# EAGLE design MCU (EAGLE 9.0.0)
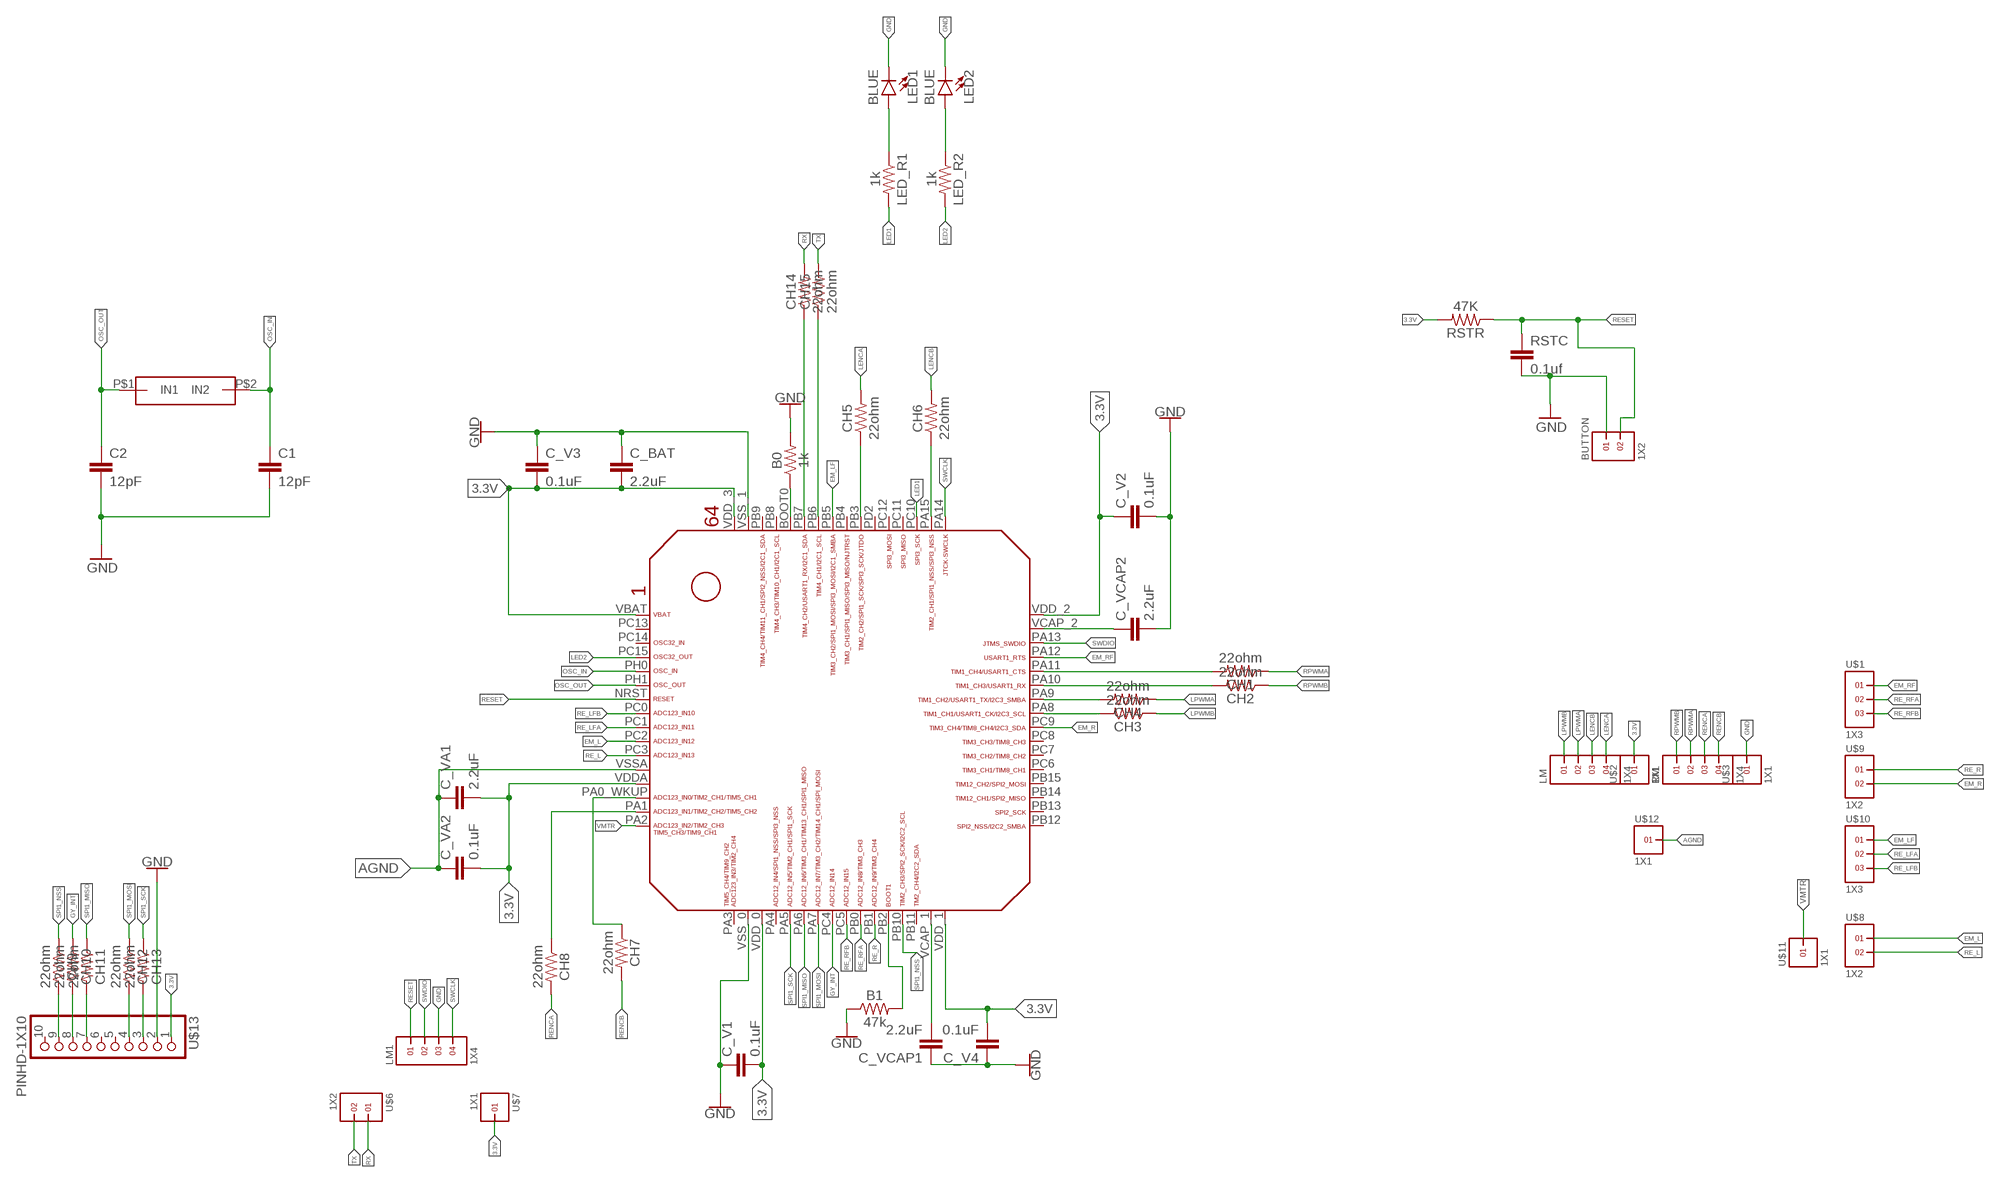
[diagram p0: schematic, sheet 1]

## Parts
B0  1k  0.75OHM-0805-1/4W-1%  [0805]
B1  47k  0.75OHM-0805-1/4W-1%  [0805]
BUTTON  1X2  [1X2]
C1  12pF  22PF-0603-50V-5%  [0603]
C2  12pF  22PF-0603-50V-5%  [0603]
C_BAT  2.2uF  22UF-0805-6.3V-20%  [0805]
C_V1  0.1uF  22UF-0805-6.3V-20%  [0805]
C_V2  0.1uF  22UF-0805-6.3V-20%  [0805]
C_V3  0.1uF  22UF-0805-6.3V-20%  [0805]
C_V4  0.1uF  22UF-0805-6.3V-20%  [0805]
C_VA1  2.2uF  22UF-0805-6.3V-20%  [0805]
C_VA2  0.1uF  22UF-0805-6.3V-20%  [0805]
C_VCAP1  2.2uF  22UF-0805-6.3V-20%  [0805]
C_VCAP2  2.2uF  22UF-0805-6.3V-20%  [0805]
CH1  22ohm  0.75OHM-0805-1/4W-1%  [0805]
CH2  22ohm  0.75OHM-0805-1/4W-1%  [0805]
CH3  22ohm  0.75OHM-0805-1/4W-1%  [0805]
CH4  22ohm  0.75OHM-0805-1/4W-1%  [0805]
CH5  22ohm  0.75OHM-0805-1/4W-1%  [0805]
CH6  22ohm  0.75OHM-0805-1/4W-1%  [0805]
CH7  22ohm  0.75OHM-0805-1/4W-1%  [0805]
CH8  22ohm  0.75OHM-0805-1/4W-1%  [0805]
CH9  22ohm  0.75OHM-0805-1/4W-1%  [0805]
CH10  22ohm  0.75OHM-0805-1/4W-1%  [0805]
CH11  22ohm  0.75OHM-0805-1/4W-1%  [0805]
CH12  22ohm  0.75OHM-0805-1/4W-1%  [0805]
CH13  22ohm  0.75OHM-0805-1/4W-1%  [0805]
CH14  22ohm  0.75OHM-0805-1/4W-1%  [0805]
CH15  22ohm  0.75OHM-0805-1/4W-1%  [0805]
LED1  BLUE  LED-BLUE1206  [LED-1206]
LED2  BLUE  LED-BLUE1206  [LED-1206]
LED_R1  1k  0.75OHM-0805-1/4W-1%  [0805]
LED_R2  1k  0.75OHM-0805-1/4W-1%  [0805]
LM  1X4  [1X4]
LM1  1X4  [1X4]
RM  1X4  [1X4]
RSTC  0.1uf  22UF-0805-6.3V-20%  [0805]
RSTR  47K  0.75OHM-0805-1/4W-1%  [0805]
U$1  1X3  [1X3]
U$2  1X1  [1X1]
U$3  1X1  [1X1]
U$4  STM32F405/415_LQFP64  [STM32F405/415_LQFP64]
U$5  OSC  [OSC]
U$6  1X2  [1X2]
U$7  1X1  [1X1]
U$8  1X2  [1X2]
U$9  1X2  [1X2]
U$10  1X3  [1X3]
U$11  1X1  [1X1]
U$12  1X1  [1X1]
U$13  PINHD-1X10  [1X10-BIG]

## Nets
3.3V: C_BAT.2 C_V1.2 C_V2.1 C_V3.2 C_V4.2 C_VA1.2 C_VA2.2 RSTR.2 U$2.1 U$4.VBAT U$4.VDD_0 U$4.VDD_1 U$4.VDD_2 U$4.VDD_3 U$4.VDDA U$7.1 U$13.1
AGND: C_VA1.1 C_VA2.1 U$4.VSSA U$12.1
EM_L: U$4.PC2 U$8.1
EM_LF: U$4.PB5 U$10.1
EM_R: U$4.PC9 U$9.2
EM_RF: U$1.1 U$4.PA12
GND: B0.2 B1.1 BUTTON.1 C1.2 C2.2 C_BAT.1 C_V1.1 C_V2.2 C_V3.1 C_V4.1 C_VCAP1.1 C_VCAP2.2 LED1.C LED2.C LM1.3 RSTC.2 U$3.1 U$4.VSS_0 U$4.VSS_1 U$13.2
GY_INT: CH10.1 U$4.PC4
INT: CH10.2 U$13.8
LED1: LED_R1.2 U$4.PC10
LED2: LED_R2.2 U$4.PC15
LENCA: CH5.2 LM.4
LENCB: CH6.2 LM.3
LPWMA: CH4.1 LM.2
LPWMB: CH3.1 LM.1
MISO: CH11.2 U$13.7
MOSI: CH12.2 U$13.4
N$1: CH3.2 U$4.PA8
N$2: CH4.2 U$4.PA9
N$3: CH1.2 U$4.PA11
N$4: CH2.2 U$4.PA10
N$5: CH6.1 U$4.PA15
N$6: CH5.1 U$4.PB3
N$7: CH7.1 U$4.PA0_WKUP(PA0_AKUP)
N$8: CH8.1 U$4.PA1
N$9: B1.2 U$4.PB2
N$10: B0.1 U$4.BOOT0
N$11: CH14.1 U$4.PB7
N$12: CH15.1 U$4.PB6
N$13: LED2.A LED_R2.1
N$14: LED1.A LED_R1.1
NSS: CH9.2 U$13.9
OSC_IN: C1.1 U$4.PH0 U$5.P$2(IN2)
OSC_OUT: C2.1 U$4.PH1 U$5.P$1(IN1)
RE_L: U$4.PC3 U$8.2
RE_LFA: U$4.PC1 U$10.2
RE_LFB: U$4.PC0 U$10.3
RE_R: U$4.PB1 U$9.1
RE_RFA: U$1.2 U$4.PB0
RE_RFB: U$1.3 U$4.PC5
RENCA: CH8.2 RM.3
RENCB: CH7.2 RM.4
RESET: BUTTON.2 LM1.1 RSTC.1 RSTR.1 U$4.NRST
RPWMA: CH1.1 RM.2
RPWMB: CH2.1 RM.1
RX: CH14.2 U$6.1
SCK: CH13.2 U$13.3
SPI1_MISO: CH11.1 U$4.PA6
SPI1_MOSI: CH12.1 U$4.PA7
SPI1_NSS: CH9.1 U$4.PB10
SPI1_SCK: CH13.1 U$4.PA5
SWCLK: LM1.4 U$4.PA14
SWDIO: LM1.2 U$4.PA13
TX: CH15.2 U$6.2
VCAP_1: C_VCAP1.2 U$4.VCAP_1
VCAP_2: C_VCAP2.1 U$4.VCAP_2
VMTR: U$4.PA2 U$11.1
Unconnected: U$4.PA3 U$4.PA4 U$4.PB4 U$4.PB8 U$4.PB9 U$4.PB11 U$4.PB12 U$4.PB13 U$4.PB14 U$4.PB15 U$4.PC6 U$4.PC7 U$4.PC8 U$4.PC11 U$4.PC12 U$4.PC13 U$4.PC14 U$4.PD2 U$13.5 U$13.6 U$13.10

## Library data of the parts
B0 B1 CH1-CH15 LED_R1 LED_R2 RSTR = SparkFun-Resistors:0.75OHM: 0.75Ω resistor A resistor is a passive two-terminal electrical component that implements electrical resistance as a circuit element. Resistors act to reduce current flow, and, at the same time, act to lower voltage levels within circuits. - Wikipedia; PROD_ID: RES-08474; VALUE: 0.75
BUTTON U$6 U$8 U$9 = headers(2mm):1X2
C1 C2 = SparkFun-Capacitors:22PF: 22pF ceramic capacitors A capacitor is a passive two-terminal electrical component used to store electrical energy temporarily in an electric field.; PROD_ID: CAP-07876; VALUE: 22pF
C_BAT C_V1-C_V4 C_VA1 C_VA2 C_VCAP1 C_VCAP2 RSTC = SparkFun-Capacitors:22UF: 22µF ceramic capacitors A capacitor is a passive two-terminal electrical component used to store electrical energy temporarily in an electric field.; PROD_ID: CAP-08402; VALUE: 22uF
LED1 LED2 = SparkFun-LED:LED-BLUE: Blue SMD LED Used in manufacturing of various products at SparkFun Packages: 0603 - SMD 0603 package [Product Link] <http://www.digikey.com/product-detail/en/SMLE12BC7TT86/511-1589-2-ND/1641808> 1206 - SMD1206 package [Product Link] <http://www.digikey.com/product-detail/en/lite-on-inc/LTST-C150TBKT/160-1643-1-ND/573584> SparkFun Products: ESP8266 Thing-Dev Board <https://www.sparkfun.com/products/13711> RedBoard <https://www.sparkfun.com/products/12757>; PROD_ID: DIO-09911
LM LM1 RM = headers(2mm):1X4
U$1 U$10 = headers(2mm):1X3
U$2 U$3 U$7 U$11 U$12 = headers(2mm):1X1
U$4 = STM32F405RG:STM32F405/415_LQFP64
U$5 = Cristal Oscillator:OSC
U$13 = adafruit:PINHD-1X10: Pin header 1x10 0.1" spacing With round pins

## Board
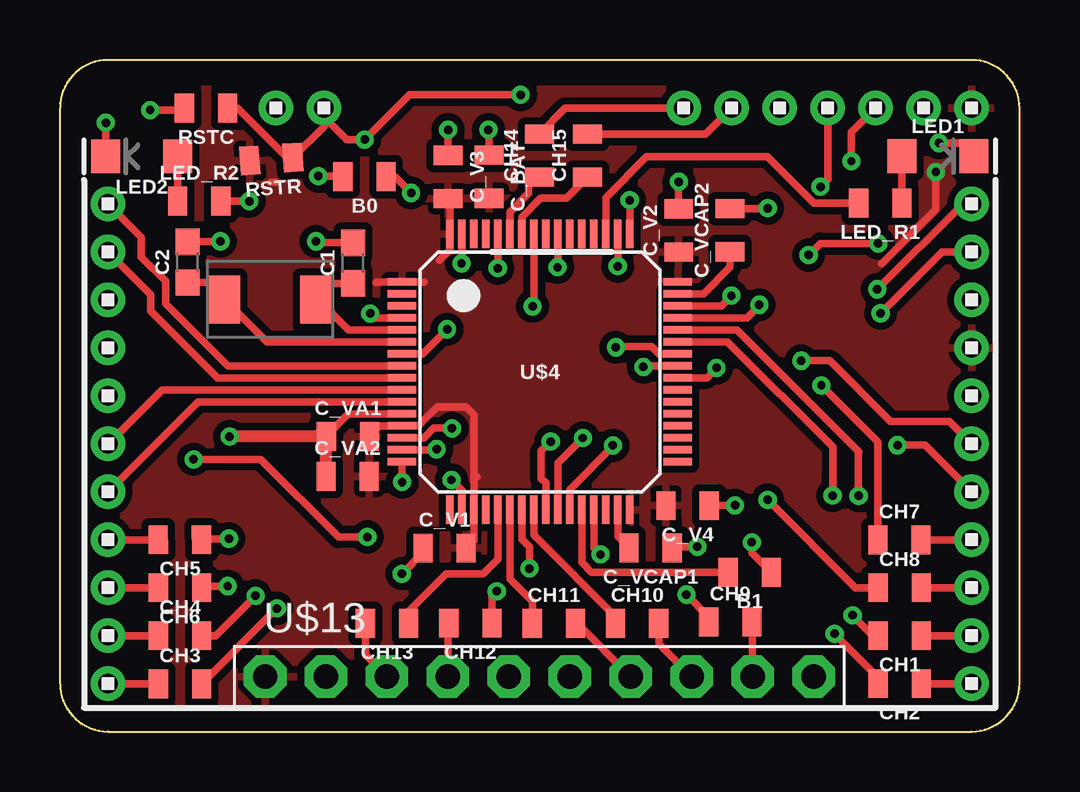
[diagram p1: board, top side]
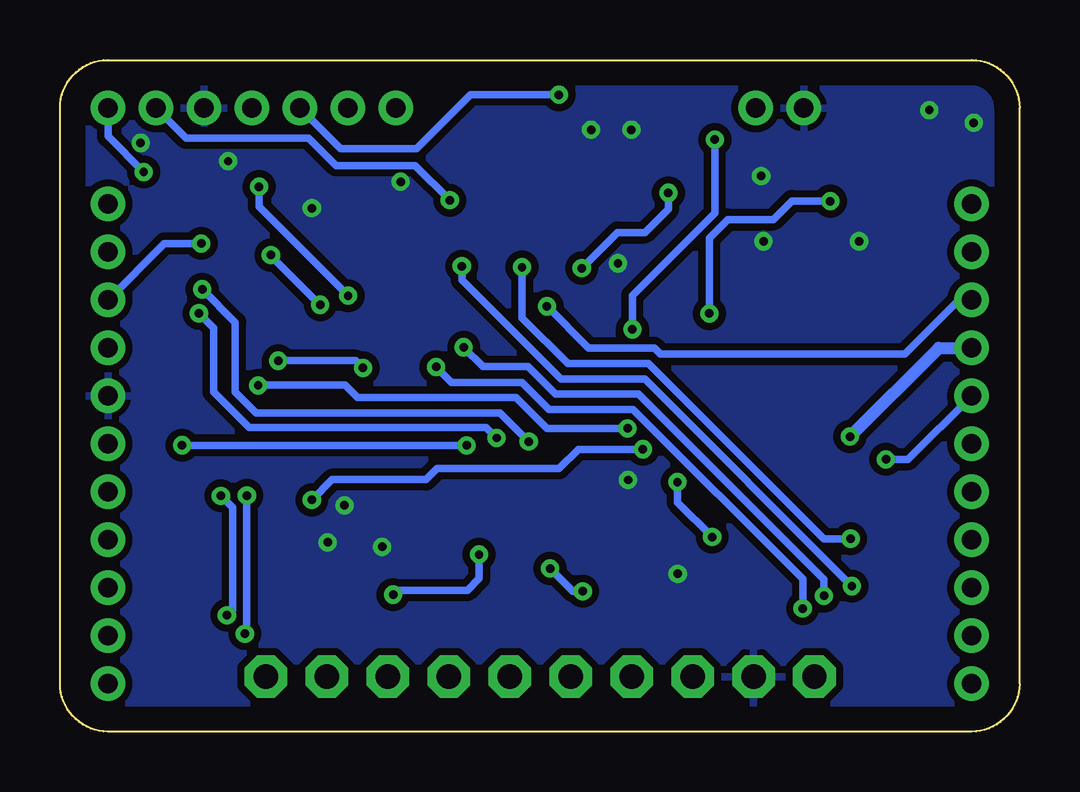
[diagram p2: board, bottom side, seen from below]

Size 40 x 28 mm. Coordinates in mm from the lower left corner, seen from the top.
Outline: 0,2 0,26 arc-90 2,28 38,28 arc-90 40,26 40,2 arc-90 38,0 2,0 arc-90 0,2
Copper layers (1*16): Top 0.035mm / dielectric 1.5mm / Bottom 0.035mm
Design rules "default": minimum track width 6mil, minimum drill 0.35mm, track to track 6mil, track to pad 6mil, pad to pad 6mil, via to via 6mil, smd to smd 6mil, copper to edge 40mil, drill to drill 6mil, minimum pad ring 10mil, minimum via ring 8mil, stop-mask expansion 4mil, vias tented up to drill 0mil, thermal gap 10mil

### Footprints (pad centres in the part's own frame; a part is rotated, then mirrored left to right if it is on the bottom)
0805 = smd 0.8 x 1.2: 1 -0.9,0; 2 0.9,0
1X2 = drill 0.8 pad 1.422: 1 -1,0; 2 1,0
0603 = smd 1.1 x 1: 1 -0.85,0; 2 0.85,0
LED-1206 = smd 1.2 x 1.4: A -1.5,0; C 1.5,0
1X4 = drill 0.8 pad 1.422: 1 -3,0; 2 -1,0; 3 1,0; 4 3,0
1X3 = drill 0.8 pad 1.422: 1 -2,0; 2 0,0; 3 2,0
1X1 = drill 0.8 pad 1.422: 1 0,0
STM32F405/415_LQFP64 = smd 0.3 x 1.2: BOOT0 -1.75,5.75; PA3 -3.75,-5.75; PA4 -2.25,-5.75; PA5 -1.75,-5.75; PA6 -1.25,-5.75; PA7 -0.75,-5.75; PA14 3.75,5.75; PA15 3.25,5.75; PB0 0.75,-5.75; PB1 1.25,-5.75; PB2 1.75,-5.75; PB3 0.75,5.75; PB4 0.25,5.75; PB5 -0.25,5.75; PB6 -0.75,5.75; PB7 -1.25,5.75; PB8 -2.25,5.75; PB9 -2.75,5.75; PB10 2.25,-5.75; PB11 2.75,-5.75; PC4 -0.25,-5.75; PC5 0.25,-5.75; PC10 2.75,5.75; PC11 2.25,5.75; PC12 1.75,5.75; PD2 1.25,5.75; VCAP_1 3.25,-5.75; VDD_0 -2.75,-5.75; VDD_1 3.75,-5.75; VDD_3 -3.75,5.75; VSS_0 -3.25,-5.75; VSS_1 -3.25,5.75 | smd 1.2 x 0.3: NRST -5.75,0.75; PA0_WKUP -5.75,-2.75; PA1 -5.75,-3.25; PA2 -5.75,-3.75; PA8 5.75,0.25; PA9 5.75,0.75; PA10 5.75,1.25; PA11 5.75,1.75; PA12 5.75,2.25; PA13 5.75,2.75; PB12 5.75,-3.75; PB13 5.75,-3.25; PB14 5.75,-2.75; PB15 5.75,-2.25; PC0 -5.75,0.25; PC1 -5.75,-0.25; PC2 -5.75,-0.75; PC3 -5.75,-1.25; PC6 5.75,-1.75; PC7 5.75,-1.25; PC8 5.75,-0.75; PC9 5.75,-0.25; PC13 -5.75,3.25; PC14 -5.75,2.75; PC15 -5.75,2.25; PH0 -5.75,1.75; PH1 -5.75,1.25; VBAT -5.75,3.75; VCAP_2 5.75,3.25; VDD_2 5.75,3.75; VDDA -5.75,-2.25; VSSA -5.75,-1.75
OSC = smd 1.3 x 2: P$1 0,0.1; P$2 3.8,0.1
1X10-BIG = drill 1.016 pad 1.778 octagon: 1 -11.43,0; 2 -8.89,0; 3 -6.35,0; 4 -3.81,0; 5 -1.27,0; 6 1.27,0; 7 3.81,0; 8 6.35,0; 9 8.89,0; 10 11.43,0

### Placement (x,y rotation side)
B0  12.69,23.13 180 top
B1  28.75,6.64 180 top
BUTTON  10,26 0 top
C1  12.21,19.53 90 top
C2  5.32,19.57 90 top
C_BAT  17.88,23.13 270 top
C_V1  16.03,7.65 0 top
C_V2  25.79,20.89 90 top
C_V3  16.18,23.12 270 top
C_V4  26.16,9.42 180 top
C_VA1  12,12.3 0 top
C_VA2  11.99,10.64 0 top
C_VCAP1  24.62,7.66 180 top
C_VCAP2  27.93,20.9 90 top
CH1  35,4 180 top
CH2  35,2 180 top
CH3  5,1.99 0 top
CH4  5,4 0 top
CH5  5,8 180.1 top
CH6  5,6 180 top
CH7  34.99,7.99 0 top
CH8  35,6 0 top
CH9  27.94,4.57 0 top
CH10  24.06,4.51 0 top
CH11  20.59,4.51 0 top
CH12  17.11,4.52 180 top
CH13  13.63,4.51 180 top
CH14  19.99,24.01 90 top
CH15  21.99,24.01 90 top
LED1  36.59,23.99 0 top
LED2  3.41,23.98 180 top
LED_R1  34.19,22.03 180 top
LED_R2  5.81,22.11 0 top
LM  2,5 90 top
LM1  33,26 0 top
RM  38,5 90 top
RSTC  6.09,25.99 180 top
RSTR  8.81,23.87 184.1 top
U$1  38,20 90 top
U$2  38,16 0 top
U$3  38,14 0 top
U$4  20,15 0 top
U$5  6.86,17.92 0 top
U$6  27,26 0 top
U$7  38,26 0 top
U$8  2,11 270 top
U$9  38,11 90 top
U$10  2,20 90 top
U$11  2,14 0 top
U$12  2,16 0 top
U$13  19.98,2.29 0 top

### Tracks (layer width: path | path; a pad name or v marks a point on that pad's centre or on a via)
3.3V  (via drill 0.35)
  Top 0.305: C_V3.2 16.25,22.15 U$4.VDD_3 16.25,20.08 15.82,19.65 | C_VA1.2 13.32,12.75 U$4.VDDA 14.93,12.75 15.16,12.97 15.16,12.98 15.71,13.53 16.92,13.53 17.25,13.2 17.25,10.48 | 17.17,7.89 C_V1.2 17.25,7.97 U$4.VDD_0 17.25,10.48 | 17.25,10.48 17.38,10.61 | U$4.VBAT | U$4.VBAT 15.17,18.74 | U$4.VBAT 13.19,18.74 13.17,18.72 | v36.51,23.33 36.51,21.76 34.26,19.51 | 8.81,22.91 8.99,22.91
  Bottom 0.305: U$7.1 38,24.82 v36.51,23.33
  pour Top (isolate 0.305): -5.02,34.34 47.27,33.34 47.27,-6.7 -5.04,-6.7 -5.04,33.35
AGND  (via drill 0.35)
  Top 0.305: U$4.VSSA 12.02,13.25 C_VA1.1
  Top 0.508: C_VA2.1 C_VA1.1 | 10.7,12.33 C_VA1.1 | C_VA1.1 v7.07,12.3
  Bottom 0.508: v7.07,12.3 3.37,16 U$12.1
EM_L
  Top 0.305: U$8.1 4.25,14.25 U$4.PC2
EM_LF  (via drill 0.35)
  Top 0.305: U$4.PB5 19.75,17.78 v19.7,17.73
  Bottom 0.305: v19.7,17.73 17.96,15.99 15.22,15.99 14.97,15.74 4.79,15.74 2.53,18 U$10.1
EM_R  (via drill 0.35)
  Top 0.305: U$4.PC9 26.96,14.75 v27.37,15.16 | v30.9,15.46 32.09,15.46 34.62,12.93 37.07,12.93 U$9.2
  Bottom 0.305: v27.37,15.16 27.67,15.46 v30.9,15.46
EM_RF  (via drill 0.35)
  Top 0.305: U$4.PA12 28.64,17.25 29.15,17.76 v29.15,17.79 | v31.21,19.87 31.69,20.35 v34.11,20.35
  Bottom 0.305: v29.15,17.79 31.21,19.85 v31.21,19.87 | v34.11,20.35 35.65,20.35 U$1.1
GND  (via drill 0.35)
  Top 0.305: C_V3.1 v16.18,25.09 | U$4.VSS_1 v16.75,19.53 v16.74,19.52 | C_VCAP1.1 25.56,7.7 v26.57,7.7 | C_V4.1 v28.13,9.42 v28.14,9.43 | B1.1 28.84,7.45 v28.84,7.89 | U$4.VSS_0 16.75,10.06 v16.32,10.49 | C_V1.1 15.13,7.46 v14.25,6.58 | C_V2.2 v25.79,22.91 v25.8,22.92 | B0.2 11.76,23.16 v10.77,23.16 | C_BAT.1 17.88,25.07 v17.86,25.09 | C_VCAP2.2 29.48,21.8 v29.5,21.82 | C2.2 6.67,20.42 v6.69,20.44 | C1.2 10.73,20.38 v10.67,20.44 | LM1.3 32.99,24.99 v32.99,23.78 | LED1.C 37.54,24.54 v36.64,24.54 | LED2.C v1.91,25.38 | RSTC.2 5.11,25.91 v3.76,25.91
  pour Bottom (isolate 0.305): -2.47,31.18 -2.47,-3.88 -2.33,-4.02 43.07,-4.02 43.07,31.18 -3.45,32.18 -2.45,31.19
GY_INT
  Top 0.305: U$4.PC4 19.75,8.2 23.16,4.79 CH10.1
INT
  Top 0.305: U$13.8 24.96,3.66 CH10.2
LED1
  Top 0.305: U$4.PC10 22.75,22.27 24.44,23.96 29.49,23.96 31.42,22.03 LED_R1.2
LED2  (via drill 0.35)
  Top 0.305: U$4.PC15 13.11,17.25 v12.93,17.43 | LED_R2.2 6.73,22.11 v7.89,22.11
  Bottom 0.305: v12.93,17.43 12.93,20.58 12.16,21.35 10.27,21.35 9.5,22.12 v7.9,22.12 v7.89,22.11
LENCA
  Top 0.305: LM.4 CH5.2
LENCB
  Top 0.305: LM.3 CH6.2
LPWMA
  Top 0.305: LM.2 CH4.1
LPWMB
  Top 0.305: LM.1 CH3.1
MISO
  Top 0.305: U$13.7 21.57,4.51 CH11.2
MOSI
  Top 0.305: U$13.4 16.17,4.48 CH12.2
N$1  (via drill 0.35)
  Top 0.305: U$4.PA8 24.37,15.25 v24.32,15.2 | v9.04,5.13 CH3.2
  Bottom 0.305: v24.32,15.2 23.68,14.56 20.75,14.56 19.62,13.43 16.11,13.43 9.04,6.36 v9.04,5.13
N$2  (via drill 0.35)
  Top 0.305: U$4.PA9 24.97,15.75 24.66,16.06 23.21,16.06 v23.17,16.02 | v8.15,5.66 6.49,4 CH4.2
  Bottom 0.305: v23.17,16.02 22.36,15.21 20.49,15.21 19.35,14.07 15.88,14.07 8.15,6.34 v8.15,5.66
N$3  (via drill 0.35)
  Top 0.305: v33.04,4.85 33.89,4 CH1.2 | U$4.PA11 28.21,16.75 33.31,11.65 33.29,11.63 v33.29,9.83
  Bottom 0.305: v33.29,9.83 32.81,9.35 32.81,5.08 v33.04,4.85
N$4  (via drill 0.35)
  Top 0.305: v32.29,4.08 34.1,2.27 CH2.2 | v32.21,9.84 32.21,10.66 32.21,10.79 32.21,11.87 27.83,16.25 U$4.PA10
  Bottom 0.305: v32.29,4.08 32.21,4.16 v32.21,9.84
N$5  (via drill 0.35)
  Top 0.305: U$4.PA15 v23.25,19.4 | v6.99,6.06 5.96,6.06 CH6.1
  Bottom 0.305: v23.25,19.4 23.25,18.82 19.12,14.69 15.62,14.69 v6.99,6.06
N$6  (via drill 0.35)
  Top 0.305: U$4.PB3 v20.75,19.37 v20.74,19.36 | 6.17,8 CH5.1 5.94,8.04 v7.04,8.04
  Bottom 0.305: v7.04,8.04 8.16,8.04 15.46,15.34 18.83,15.34 20.74,17.25 v20.74,19.36
N$7  (via drill 0.35)
  Top 0.305: 15.03,12.25 U$4.PA0_WKUP 15.17,12.25 15.57,12.65 v16.33,12.65 v16.34,12.64 | v31.74,14.43 34.09,12.08 CH7.1
  Bottom 0.305: v16.34,12.64 19.7,12.64 20.98,13.92 27.59,13.92 28.11,14.44 v31.73,14.44 v31.74,14.43
N$8  (via drill 0.35)
  Top 0.305: U$4.PA1 15.68,11.75 v15.7,11.77 | v29.5,9.66 33.16,6 CH8.1
  Bottom 0.305: v15.7,11.77 18.39,11.77 19.19,10.97 24.29,10.97 24.75,10.51 28.65,10.51 v29.5,9.66
N$9
  Top 0.305: B1.2 22.16,6.64 21.75,7.05 U$4.PB2
N$10  (via drill 0.35)
  Top 0.305: U$4.BOOT0 v18.25,19.32 | v14.64,22.46 13.97,23.13 B0.1
  Bottom 0.305: v18.25,19.32 16.76,20.81 15.62,20.81 14.64,21.79 v14.64,22.46
N$11
  Top 0.305: U$4.PB7 18.75,21.66 19.54,22.45 19.54,22.73 19.92,23.11 CH14.1
N$12
  Top 0.305: U$4.PB6 19.25,21.45 20.04,22.24 21.12,22.24 CH15.1
N$13
  Top 0.305: LED_R2.1 LED2.A
N$14
  Top 0.305: LED_R1.1 LED1.A
NSS
  Top 0.305: U$13.9 28.87,4.54 CH9.2
OSC_IN
  Top 0.305: C1.1 11.32,18.68 10.71,18.07 | 10.71,18.07 U$5.P$2 | U$4.PH0 12.03,16.75 10.71,18.07
OSC_OUT
  Top 0.305: U$4.PH1 8.63,16.25 U$5.P$1 6.16,18.72 C2.1
RE_L
  Top 0.305: U$8.2 5.75,13.75 U$4.PC3
RE_LFA
  Top 0.305: U$4.PC1 6.57,14.75 3.78,17.54 3.78,18.22 U$10.2
RE_LFB
  Top 0.305: U$10.3 3.39,20.61 3.39,19.79 4.4,18.78 4.4,17.85 7,15.25 U$4.PC0
RE_R  (via drill 0.35)
  Top 0.305: U$4.PB1 21.25,10.1 23.05,11.9 v23.05,11.93 | v34.91,11.94 36.06,11.94 U$9.1
  Bottom 0.305: v23.05,11.93 v34.9,11.93 v34.91,11.94
RE_RFA  (via drill 0.35)
  Top 0.305: v21.8,12.24 20.75,11.19 U$4.PB0 | v34.21,17.44 36.77,20 U$1.2
  Bottom 0.305: v21.8,12.24 22.23,12.67 32.11,12.67 33.6,14.16 33.6,16.83 v34.21,17.44
RE_RFB  (via drill 0.35)
  Top 0.305: U$4.PC5 20.25,10.36 20.06,10.55 20.06,11.69 v20.46,12.09 | v34.07,18.44 37.63,22 U$1.3
  Bottom 0.305: v20.46,12.09 21.66,13.29 31.83,13.29 32.69,14.15 32.69,17.06 v34.07,18.44
RENCA
  Top 0.305: CH8.2 RM.3
RENCB
  Top 0.305: CH7.2 RM.4
RESET  (via drill 0.35)
  Top 0.305: U$4.NRST 15.12,15.75 v16.14,16.77 | v19.2,26.55 14.57,26.55 v12.7,24.68 11.94,24.68 11,25.62 | 9.61,24.23 RSTR.1 | 11,25.62 BUTTON.2 | RSTC.1 7.41,25.99 9.47,23.93 RSTR.1 | RSTR.1 11,25.23 11,25.62
  Bottom 0.305: v16.14,16.77 16.14,18.18 12.7,21.62 v12.7,24.68 | v19.2,26.55 22.88,26.55 25.13,24.3 28.3,24.3 LM1.1
RPWMA
  Top 0.305: CH1.1 RM.2
RPWMB
  Top 0.305: CH2.1 RM.1
RX
  Top 0.305: CH14.2 21.06,25.98 25.98,25.98 U$6.1
SCK
  Top 0.305: U$13.3 12.73,3.19 CH13.2
SPI1_MISO
  Top 0.305: U$4.PA6 18.75,6.37 19.69,5.43 CH11.1
SPI1_MOSI  (via drill 0.35)
  Top 0.305: v18.21,5.85 18.01,5.65 CH12.1 | U$4.PA7 19.25,8.02 19.57,7.7 v19.57,6.8
  Bottom 0.305: v18.21,5.85 18.62,5.85 v19.57,6.8
SPI1_NSS  (via drill 0.35)
  Top 0.305: 27.04,4.82 27.04,4.78 | CH9.1 27.04,4.66 27.04,4.78 | U$4.PB10 22.25,7.66 v22.53,7.38 | v26.11,5.71 27.04,4.78
  Bottom 0.305: v22.53,7.38 22.53,6.38 23.02,5.89 25.93,5.89 v26.11,5.71
SPI1_SCK
  Top 0.305: U$4.PA5 18.25,7.2 17.63,6.58 16.09,6.58 14.53,5.02 CH13.1
SWCLK  (via drill 0.35)
  Top 0.305: U$4.PA14 v23.75,22.15
  Bottom 0.305: v23.75,22.15 25.2,23.6 26.08,23.6 26.09,23.6 28.48,23.6 29.63,24.75 34.75,24.75 LM1.4
SWDIO  (via drill 0.35)
  Top 0.305: U$4.PA13 27.57,17.75 v27.99,18.17 | LM1.2 32,23.01 v31.7,22.71
  Bottom 0.305: v31.7,22.71 31.7,21.88 v27.99,18.17
TX
  Top 0.305: CH15.2 26.91,24.91 U$6.2
VCAP_1
  Top 0.305: U$4.VCAP_1 23.25,8.13 C_VCAP1.2
VCAP_2
  Top 0.305: U$4.VCAP_2 26.82,18.25 27.93,19.36 C_VCAP2.1
VMTR  (via drill 0.35)
  Top 0.305: U$4.PA2 v14.25,10.41 v14.26,10.4 | v12.81,8.11 11.61,8.11 8.37,11.35 v5.57,11.35
  Bottom 0.305: v14.26,10.4 14.26,9.56 v12.81,8.11 | v5.57,11.35 4.65,11.35 U$11.1